# Altium schematic sheet Voltage_Divider.SchDoc
size A4
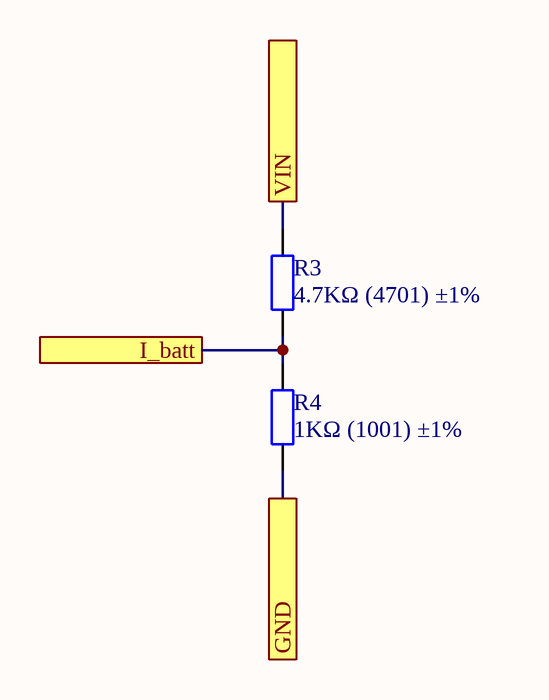
[diagram p0: Voltage_Divider.SchDoc]

## Parts
R3  4.7KΩ (4701) ±1%  [0402_R]
R4  1KΩ (1001) ±1%  [0402_R]

## Ports
GND, I_batt, VIN

## Nets
GND: R4.1 ; port GND
I_batt: R3.1 R4.2 ; port I_batt
VIN: R3.2 ; port VIN

## Library data of the parts
R3 = 0402 4.7KΩ (4701) 1%: 贴片电阻; ComponentLink1Description: 供应商链接; ComponentLink1URL: http://www.szlcsc.com/product/details_26643.html; Package: 0402; Supplier: LC; SuppliersPartNumber: C25900
R4 = 0402 1KΩ (1001) 1%: 贴片电阻; ComponentLink1Description: 供应商链接; ComponentLink1URL: http://www.szlcsc.com/product/details_12256.html; Package: 0402; Supplier: LC; SuppliersPartNumber: C11702